# Altium schematic sheet 202011AWSNP02.SchDoc
size A4
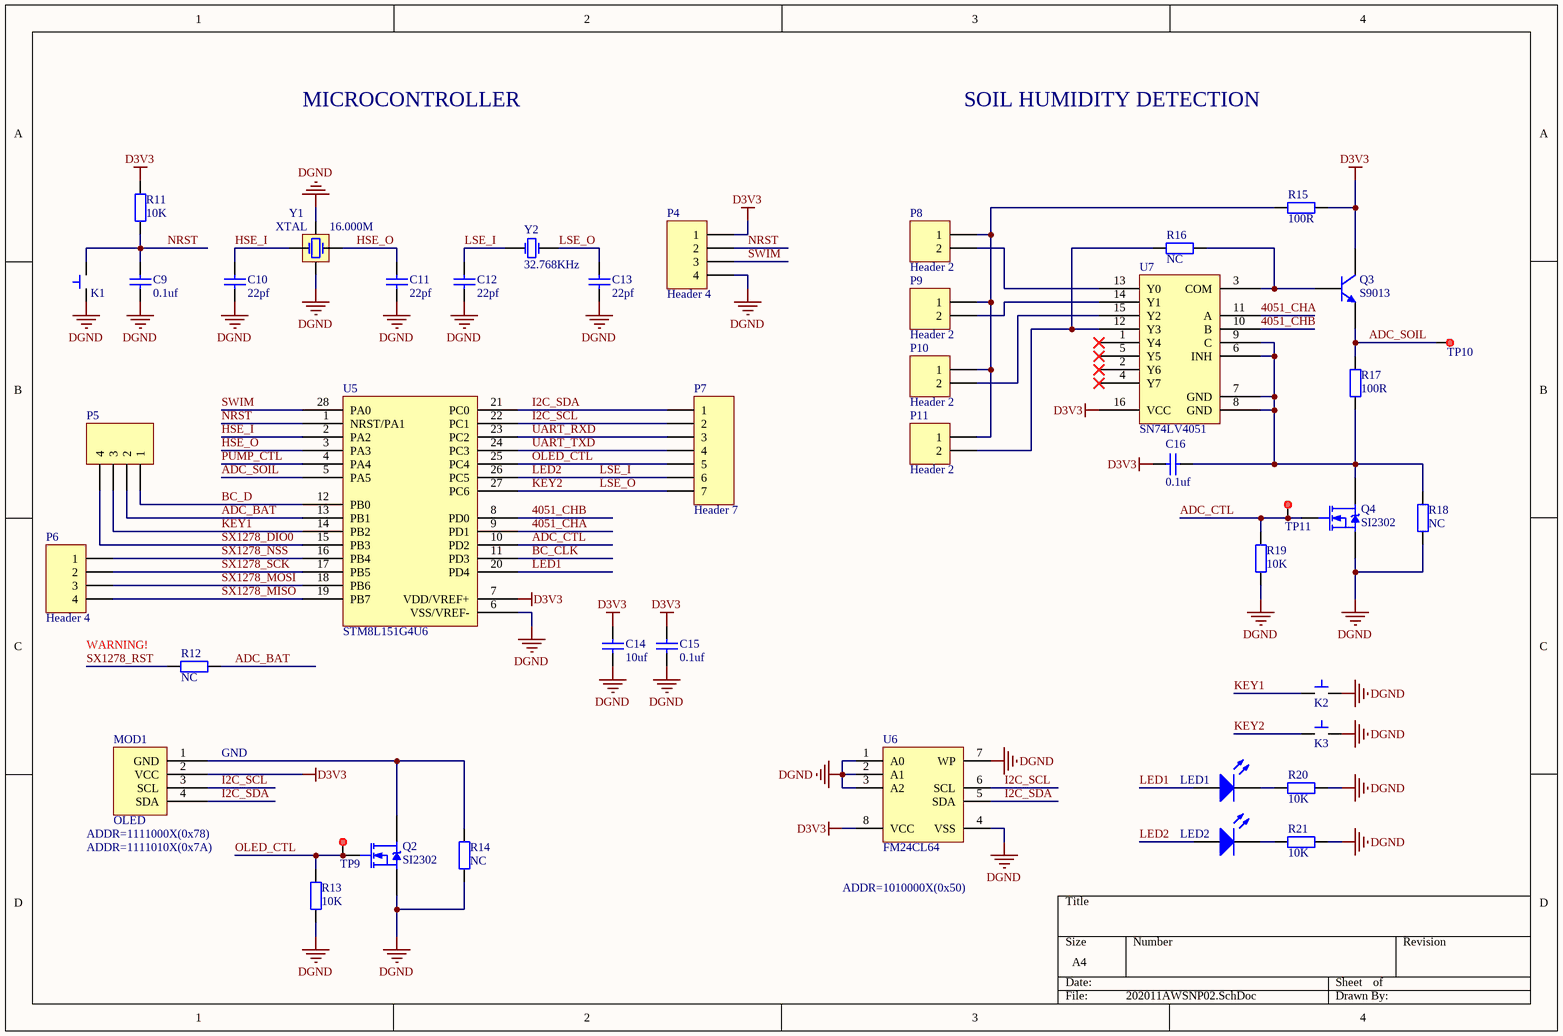
[diagram p0: 202011AWSNP02.SchDoc]

## Parts
C9  value 0.1uf  [C0805]  (hidden comment: Cap)
C10  value 22pf  [C0805]  (hidden comment: Cap)
C11  value 22pf  [C0805]  (hidden comment: Cap)
C12  value 22pf  [C0805]  (hidden comment: Cap)
C13  value 22pf  [C0805]  (hidden comment: Cap)
C14  value 10uf  [C0805]  (hidden comment: Cap)
C15  value 0.1uf  [C0805]  (hidden comment: Cap)
C16  value 0.1uf  [C0805]  (hidden comment: Cap)
K1  Button  [Button-SMT-Small]  (value not drawn)
K2  Button  [Button-SMT-Small]  (value not drawn)
K3  Button  [Button-SMT-Small]  (value not drawn)
LED1  LED  [LED1206]  (value not drawn)
LED2  LED  [LED1206]  (value not drawn)
MOD1  OLED  [MODULE OLED-4P-0.96]
P4  Header 4  [HDR1X4]
P5  Header 4  [HDR1X4]  (value not drawn)
P6  Header 4  [HDR1X4]
P7  Header 7  [HDR1X7]
P8  Header 2  [HDR1X2]
P9  Header 2  [HDR1X2]
P10  Header 2  [HDR1X2]
P11  Header 2  [HDR1X2]
Q2  SI2302  [SI2302-SOT23]
Q3  S9013  [SOT-23]
Q4  SI2302  [SI2302-SOT23]
R11  value 10K  [R0805]  (hidden comment: Res)
R12  value NC  [R0805]  (hidden comment: Res)
R13  value 10K  [R0805]  (hidden comment: Res)
R14  value NC  [R0805]  (hidden comment: Res)
R15  value 100R  [R0805]  (hidden comment: Res)
R16  value NC  [R0805]  (hidden comment: Res)
R17  value 100R  [R0805]  (hidden comment: Res)
R18  value NC  [R0805]  (hidden comment: Res)
R19  value 10K  [R0805]  (hidden comment: Res)
R20  value 10K  [R0805]  (hidden comment: Res)
R21  value 10K  [R0805]  (hidden comment: Res)
TP9  TestPoint  [TestPoint-R30]  (value not drawn)
TP10  TestPoint  [TestPoint-R30]  (value not drawn)
TP11  TestPoint  [TestPoint-R30]  (value not drawn)
U5  STM8L151G4U6  [STM8L151G4U6-UFQFN28]
U6  FM24CL64  [FM24CL64-SOIC8]
U7  SN74LV4051  [SN74LV4051-TSSOP16]
Y1  XTAL  value 16.000M  [XTAL-3225]
Y2  value 32.768KHz  [XTAL-3215]  (hidden comment: XTAL)

## Nets
D3V3: C14.2 C15.2 C16.2 MOD1.2(VCC) P4.1 Q3.C R11.1 R15.2 U5.7(VDD/VREF+) U6.8(VCC) U7.16(VCC)
DGND: C9.1 C10.1 C11.1 C12.1 C13.1 C14.1 C15.1 K1.2(OUT) K2.2(OUT) K3.2(OUT) P4.4 Q2.2(S) Q4.2(S) R13.1 R14.1 R18.1 R19.1 R20.1 R21.1 U5.6(VSS/VREF-) U6.1(A0) U6.2(A1) U6.3(A2) U6.4(VSS) U6.7(WP) Y1.2(GND) Y1.4(GND)
4051_CHA: U5.9(PD1) U7.11(A)
4051_CHB: U5.8(PD0) U7.10(B)
ADC_BAT: P5.2 R12.1 U5.13(PB1)
ADC_CTL: Q4.1(G) R19.2 TP11.1 U5.10(PD2)
ADC_SOIL: Q3.E R17.2 TP10.1 U5.5(PA5)
BC_CLK: U5.11(PD3)
BC_D: P5.1 U5.12(PB0)
HSE_I: C10.2 U5.2(PA2) Y1.1(OSC1)
HSE_O: C11.2 U5.3(PA3) Y1.3(OSC2)
I2C_SCL: MOD1.3(SCL) P7.2 U5.22(PC1) U6.6(SCL)
I2C_SDA: MOD1.4(SDA) P7.1 U5.21(PC0) U6.5(SDA)
KEY1: K2.1(IN) P5.3 U5.14(PB2)
KEY2: C13.2 K3.1(IN) P7.7 U5.27(PC6) Y2.2(OSC2)  [also labelled LSE_O]
LED1: LED1.1(A) U5.20(PD4)
LED2: C12.2 LED2.1(A) P7.6 U5.26(PC5) Y2.1(OSC1)  [also labelled LSE_I]
NRST: C9.2 K1.1(IN) P4.2 R11.2 U5.1(NRST/PA1)
OLED_CTL: P7.5 Q2.1(G) R13.2 TP9.1 U5.25(PC4)
PUMP_CTL: U5.4(PA4)
SWIM: P4.3 U5.28(PA0)
SX1278_DIO0: P5.4 U5.15(PB3)
SX1278_MISO: P6.4 U5.19(PB7)
SX1278_MOSI: P6.3 U5.18(PB6)
SX1278_NSS: P6.1 U5.16(PB4)
SX1278_RST: R12.2
SX1278_SCK: P6.2 U5.17(PB5)
UART_RXD: P7.3 U5.23(PC2)
UART_TXD: P7.4 U5.24(PC3)
NetC16_1: C16.1 Q4.3(D) R17.1 R18.2 U7.6(INH) U7.7(GND) U7.8(GND) U7.9(C)
NetLED1_2: LED1.2(K) R20.2
NetLED2_2: LED2.2(K) R21.2
NetMOD1_1: MOD1.1(GND) Q2.3(D) R14.2
NetP8_1: P8.1 P9.1 P10.1 P11.1 R15.1
NetP8_2: P8.2 U7.13(Y0)
NetP9_2: P9.2 U7.14(Y1)
NetP10_2: P10.2 U7.15(Y2)
NetP11_2: P11.2 R16.1 U7.12(Y3)
NetQ3_B: Q3.B R16.2 U7.3(COM)

Not connected (* = marked no-connect by the designer): U7 1(Y4)* 2(Y6)* 4(Y7)* 5(Y5)*

## Notes on the sheet
- MICROCONTROLLER
- SOIL HUMIDITY DETECTION
- WARNING!
- GND
- (near MOD1) ADDR=1111000X(0x78)
- (near MOD1) ADDR=1111010X(0x7A)
- ADDR=1010000X(0x50)

## Library data of the parts
K1-K3 = Button: 轻触开关
MOD1 = Module OLED: OLED显示模块
P4-P6 = Header 4: Header, 4-Pin; LatestRevisionDate: 17-Jul-2002; LatestRevisionNote: Re-released for DXP Platform.; Publisher: Altium Limited
P7 = Header 7: Header, 7-Pin; LatestRevisionDate: 17-Jul-2002; LatestRevisionNote: Re-released for DXP Platform.; Publisher: Altium Limited
P8-P11 = Header 2: Header, 2-Pin; LatestRevisionDate: 17-Jul-2002; LatestRevisionNote: Re-released for DXP Platform.; Publisher: Altium Limited
Q2 Q4 = SI2302: N-Channel 20 V (D-S) MOSFET
Q3 = NPN: NPN General Purpose Amplifier
R11-R21 = Res: 电阻
TP9-TP11 = TestPoint: 测试点
U5 = STM8L151G4U6: 8-bit ultra-low-power MCU, up to 32 KB Flash, 1 KB Data EEPROM,RTC, LCD, timers, USART, I2C, SPI, ADC, DAC, comparators
U6 = FM24CL64: 64Kb Serial 3V FRAM Memory
U7 = SN74LV4051: SN74LV4051A 8-Channel Analog Multiplexers and Demultiplexers
Y1 = XTAL3: 无源晶振
Y2 = XTAL: Crystal Oscillator